# Altium schematic sheet MainBoard.SchDoc
size 420 x 297 mm; SheetNumber: 1; SheetTotal: 1
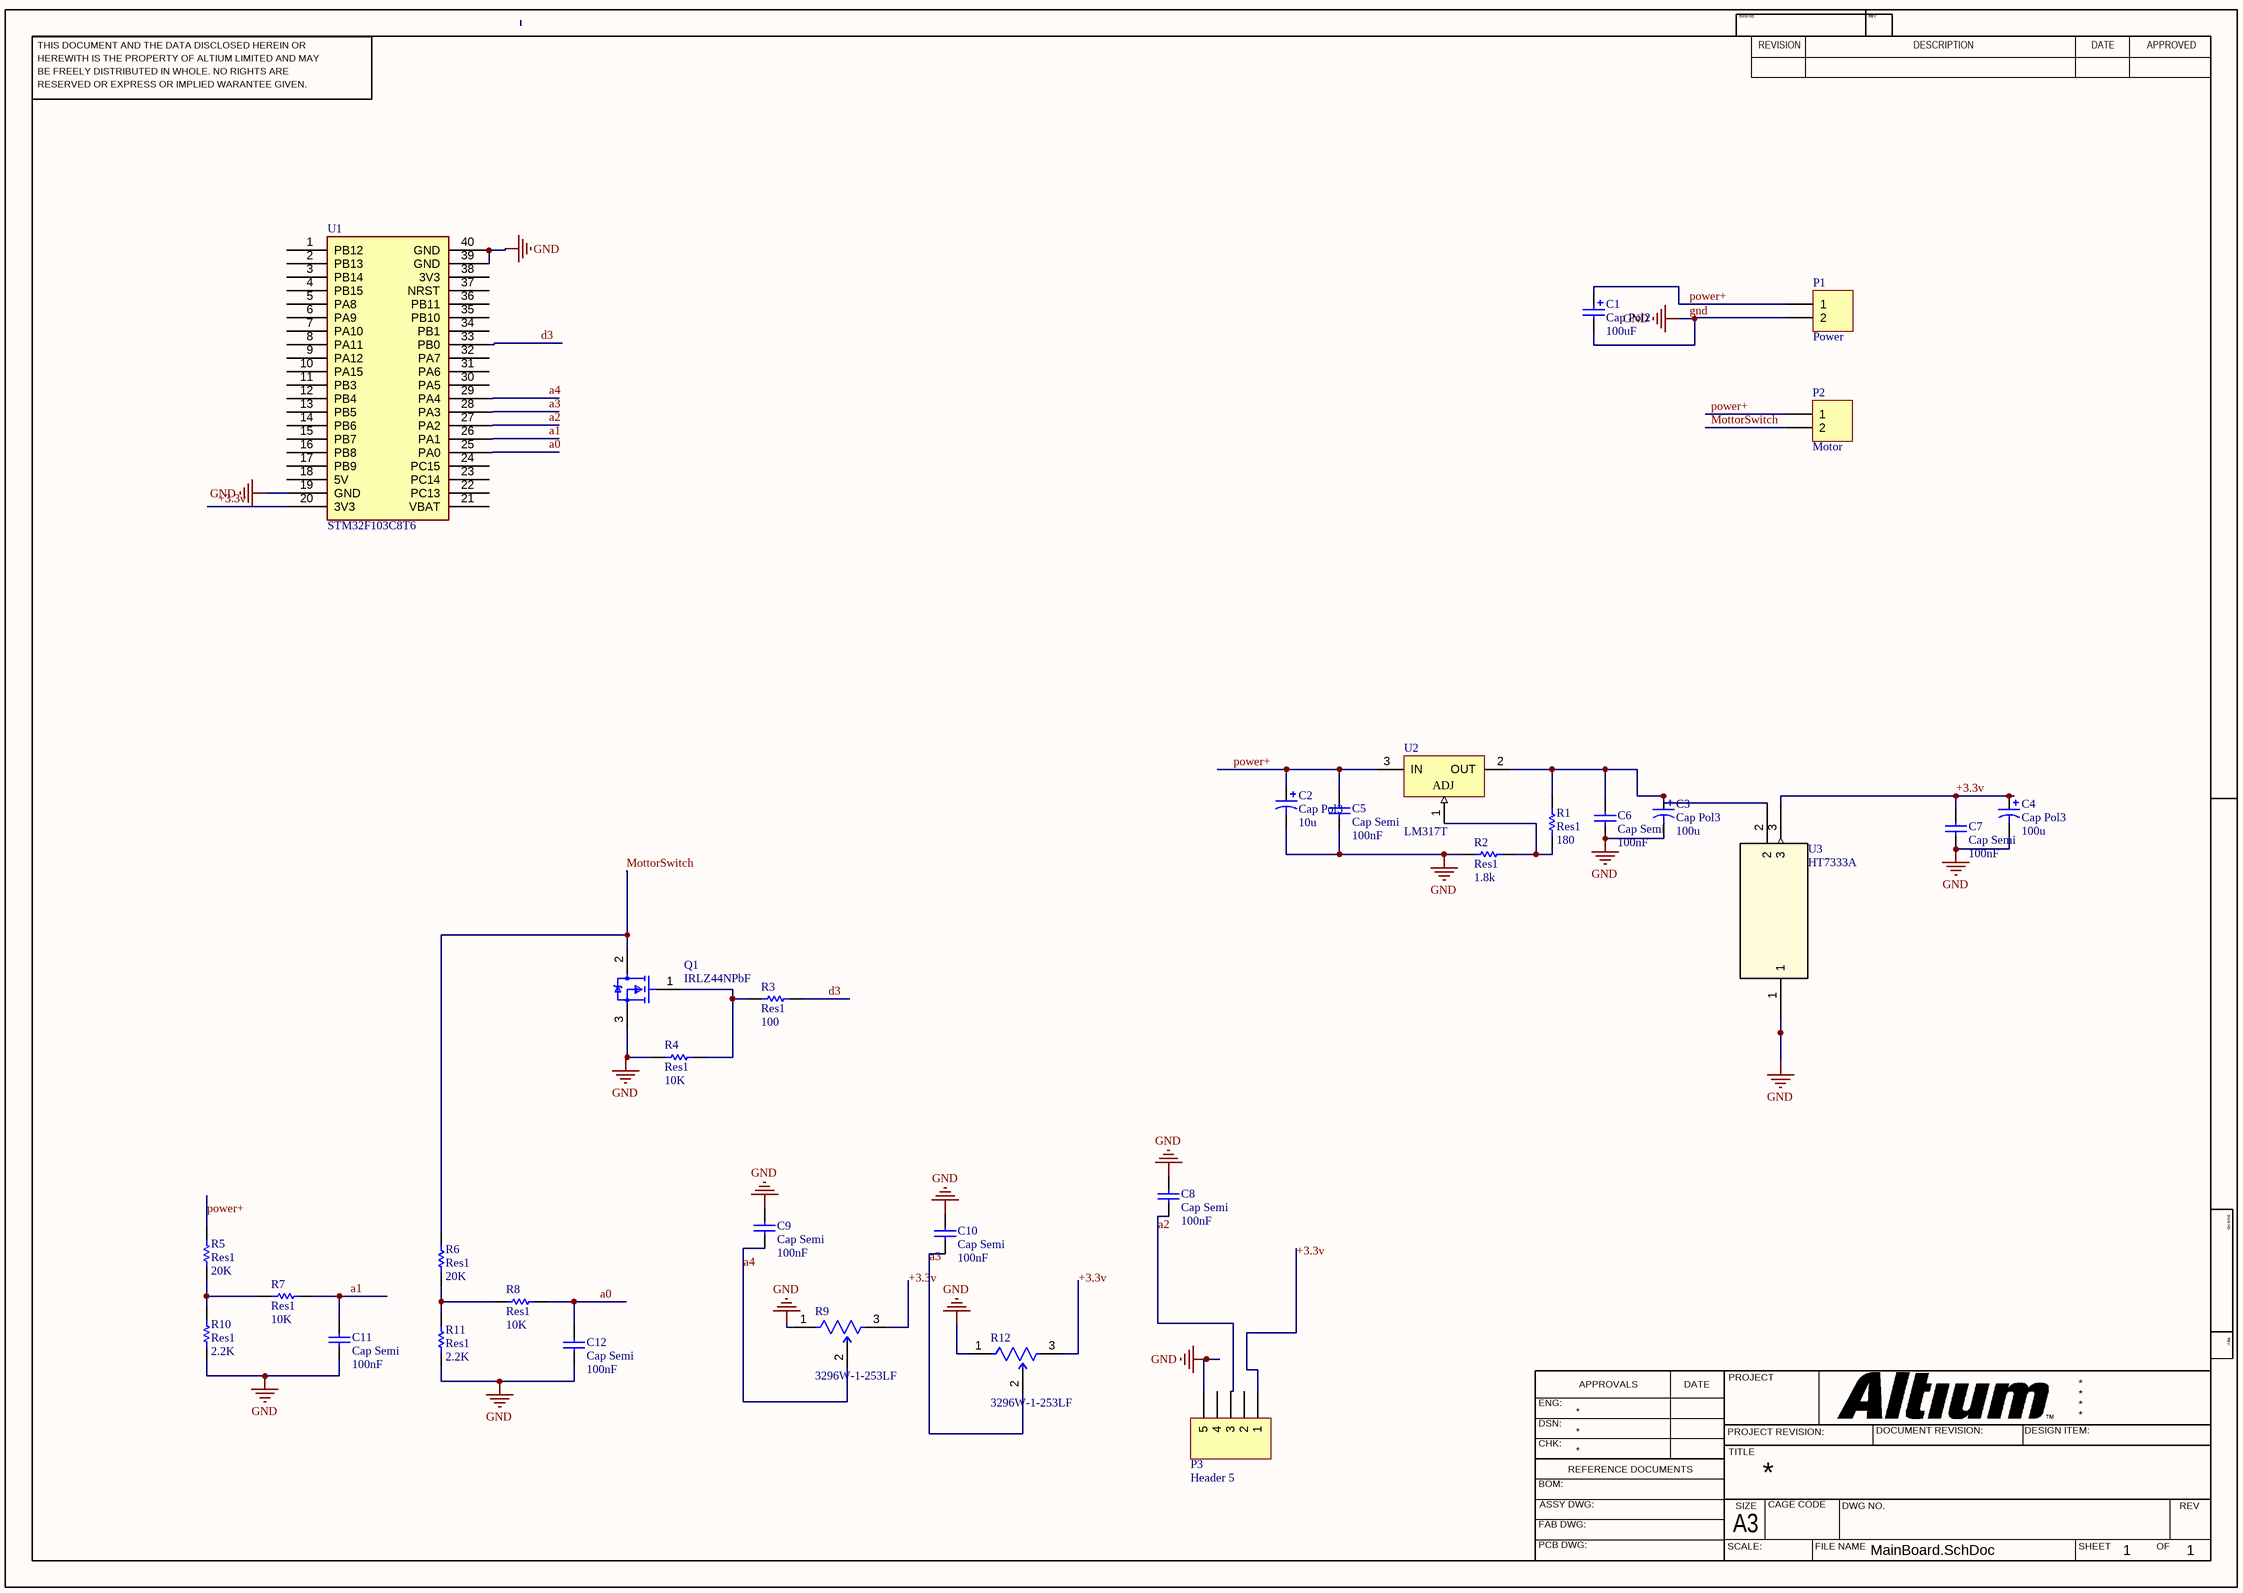
[diagram p0: MainBoard.SchDoc]

## Parts
C1  Cap Pol2  value 100uF  [RB5-10.5]
C2  Cap Pol3  value 10u  [RAD-0.1]
C3  Cap Pol3  value 100u  [RAD-0.1]
C4  Cap Pol3  value 100u  [RAD-0.1]
C5  Cap Semi  value 100nF  [RAD-0.1]
C6  Cap Semi  value 100nF  [RAD-0.1]
C7  Cap Semi  value 100nF  [RAD-0.1]
C8  Cap Semi  value 100nF  [RAD-0.1]
C9  Cap Semi  value 100nF  [RAD-0.1]
C10  Cap Semi  value 100nF  [RAD-0.1]
C11  Cap Semi  value 100nF  [RAD-0.1]
C12  Cap Semi  value 100nF  [RAD-0.1]
P1  Power  [HDR1X2]
P2  Motor  [HDR1X2]
P3  Header 5  [HDR1X5]
Q1  IRLZ44NPbF  [FP-PG-TO220-3-MFG]
R1  Res1  value 180  [1608[0603]]
R2  Res1  value 1.8k  [1608[0603]]
R3  Res1  value 100  [1608[0603]]
R4  Res1  value 10K  [1608[0603]]
R5  Res1  value 20K  [1608[0603]]
R6  Res1  value 20K  [1608[0603]]
R7  Res1  value 10K  [1608[0603]]
R8  Res1  value 10K  [1608[0603]]
R9  3296W-1-253LF  [FP-3296W-MFG]
R10  Res1  value 2.2K  [1608[0603]]
R11  Res1  value 2.2K  [1608[0603]]
R12  3296W-1-253LF  [FP-3296W-MFG]
U1  STM32F103C8T6  [Stm32 BluePill]
U2  LM317T  [TO-220]
U3  HT7333A  [SOT_7136-1_HLT]

## Nets
gnd: C1.2 C2.2 C3.2 C4.2 C5.1 C6.1 C7.1 C8.2 C9.2 C10.2 C11.1 C12.1 P1.2 P3.5 Q1.3(S) R2.1 R4.1 R9.1(CCW) R10.1 R11.1 R12.1(CCW) U1.19(GND) U1.39(GND) U1.40(GND) U3.1
+3.3v: C4.1 C7.2 P3.1 R9.3(CW) R12.3(CW) U1.20(3V3) U3.3
a0: C12.2 R8.2 U1.25(PA0)
a1: C11.2 R7.2 U1.26(PA1)
a2: C8.1 P3.3 U1.27(PA2)
a3: C10.1 R12.2(WIPER) U1.28(PA3)
a4: C9.1 R9.2(WIPER) U1.29(PA4)
d3: R3.2 U1.33(PB0)
MottorSwitch: P2.2 Q1.2(D) R6.2
power+: C1.1 C2.1 C5.2 P1.1 P2.1 R5.2 U2.3(IN)
NetC3_1: C3.1 C6.2 R1.2 U2.2(OUT) U3.2
NetQ1_1: Q1.1(G) R3.1 R4.2
NetR1_1: R1.1 R2.2 U2.1(ADJ)
NetR5_1: R5.1 R7.1 R10.2
NetR6_1: R6.1 R8.1 R11.2

Not connected (* = marked no-connect by the designer): P3 2 4; U1 1(PB12) 2(PB13) 3(PB14) 4(PB15) 5(PA8) 6(PA9) 7(PA10) 8(PA11) 9(PA12) 10(PA15) 11(PB3) 12(PB4) 13(PB5) 14(PB6) 15(PB7) 16(PB8) 17(PB9) 18(5V) 21(VBAT) 22(PC13) 23(PC14) 24(PC15) 30(PA5) 31(PA6) 32(PA7) 34(PB1) 35(PB10) 36(PB11) 37(NRST) 38(3V3)

## Notes on the sheet
- THIS DOCUMENT AND THE DATA DISCLOSED HEREIN OR
- HEREWITH IS THE PROPERTY OF ALTIUM LIMITED AND MAY
- DWG NO:
- REVISION
- REV:
- DESCRIPTION
- DATE
- APPROVED
- BE FREELY DISTRIBUTED IN WHOLE. NO RIGHTS ARE
- RESERVED OR EXPRESS OR IMPLIED WARANTEE GIVEN.
- ENG:
- APPROVALS
- PROJECT
- DSN:
- CHK:
- REFERENCE DOCUMENTS
- PROJECT REVISION:
- TITLE
- DOCUMENT REVISION:
- DESIGN ITEM:
- BOM:
- FAB DWG:
- PCB DWG:
- ASSY DWG:
- SCALE:
- A3
- SIZE
- CAGE CODE
- FILE NAME
- DWG NO.
- SHEET
- OF
- REV

## Library data of the parts
C1 = Cap Pol2: Polarized Capacitor (Axial); Published: 8-Jun-2000; LatestRevisionDate: 17-Jul-2002; LatestRevisionNote: Re-released for DXP Platform.; PackageReference: POLAR0.8; Publisher: Altium Limited; PackageDescription: Polarized Capacitor; 2 Leads
C2-C4 = Cap Pol3: Polarized Capacitor (Surface Mount); Published: 8-Jun-2000; LatestRevisionDate: 29-May-2009; LatestRevisionNote: IPC-7351 Footprint Added.; PackageReference: C0805; Publisher: Altium Limited; PackageDescription: Chip Capacitor
C5-C12 = Cap Semi: Capacitor (Semiconductor SIM Model); Published: 8-Jun-2000; LatestRevisionDate: 29-May-2009; LatestRevisionNote: IPC-7351 Footprint Added.; PackageReference: C1206; Publisher: Altium Limited; PackageDescription: Chip Capacitor
P1 P2 = Header 2: Header, 2-Pin; LatestRevisionDate: 17-Jul-2002; LatestRevisionNote: Re-released for DXP Platform.; Publisher: Altium Limited
P3 = Header 5: Header, 5-Pin; LatestRevisionDate: 17-Jul-2002; LatestRevisionNote: Re-released for DXP Platform.; Publisher: Altium Limited
Q1 = CMP-32901-000488-1: MOSFET N-CH 55V 47A TO220AB; Turn-On Delay Time: 11ns; Gate to Source Voltage (Vgs): 16V; Element Configuration: Single; Rds On Max: 22mR; Turn-Off Delay Time: 26ns; Max Power Dissipation: 110W; Threshold Voltage: 2V; Drain to Source Resistance: 35mR; Input Capacitance: 1.7nF; Continuous Drain Current (ID): 47A; Case/Package: TO-220; Lead Free: Lead Free; Halogen Free: Halogen Free; Packaging: Rail/Tube; Length: 0.414inch; Min Operating Temperature: -55°C; REACH SVHC: No SVHC; Number of Pins: 3; Width: 0.185inch; Drain to Source Voltage (Vdss): 55V; Power Dissipation: 110W; RoHS Compliant: Yes; Max Operating Temperature: 175°C; Height: 0.6inch; Max Dual Supply Voltage: 55V; Drain to Source Breakdown Voltage: 55V; Mount: Through Hole
R1-R8 R10 R11 = Res1: Resistor; Published: 8-Jun-2000; LatestRevisionDate: 17-Jul-2002; LatestRevisionNote: Re-released for DXP Platform.; PackageReference: AXIAL-0.3; Publisher: Altium Limited; PackageDescription: Axial Device, Thru-Hole; 2 Leads; 0.3 in Pin Spacing
R9 R12 = CMP-07234-000034-1: TRIMMER 25K OHM 0.5W PC PIN TOP; Temperature Coefficient: 100ppm/°C; Resistance Tolerance: 10%; Resistance: 25kR; Power Rating: 500mW; Number of Turns: 25; Voltage Rating (DC): 300V; Taper: Linear; Resistor Type: Cermet; REACH SVHC: No SVHC; Height: 0.395inch; Military Standard: Not; Color: Blue; Tolerance: 10%; Depth: 4.83mm; Package Quantity: 50; Termination: Pin; Radiation Hardening: No; Packaging: Rail/Tube; Lead Free: Lead Free; Length: 9.53mm; Series: 3296; Weight: 0.03oz; RoHS Compliant: Yes; Mount: Panel; Max Power Dissipation: 500mW; Width: 9.53mm; Technology: CERMET; Min Operating Temperature: -55°C; Max Operating Temperature: 125°C
U1 = BluePill: Designed By @Alixahedi
U2 = CMP-0244-00444-1: 1.5A, 1.2V to 37V Adjustable Voltage Regulator, 3-Pin TO-220; PackageVersion: 2011; ComponentLink1URL: http://www.st.com; ComponentLink2URL: http://www.st.com/internet/com/TECHNICAL_RESOURCES/TECHNICAL_LITERATURE/DATASHEET/CD00000455.pdf; PackageDescription: TO, Thru-Hole, Vertical, Heatsink Mounted; 3 In-Line Leads; Pitch 2.54 mm; PackageReference: TO-220; ComponentLink1Description: Manufacturer URL; ComponentLink3URL: http://www.st.com/internet/com/TECHNICAL_RESOURCES/TECHNICAL_LITERATURE/PACKAGE_INFORMATION/CD00004649.pdf; DatasheetVersion: 1/11/2011; ComponentLink2Description: Datasheet; ComponentLink3Description: Package Specification
U3 = HT7333A: Description; Manufacturer_Name: Holtek; Copyright: Copyright (C) 2026 Ultra Librarian. All rights reserved.; Manufacturer_Part_Number: HT7333A; RefDes: RefDes; Type: Type